# EAGLE design +YSOLAR PANEL (EAGLE 8.7.0)
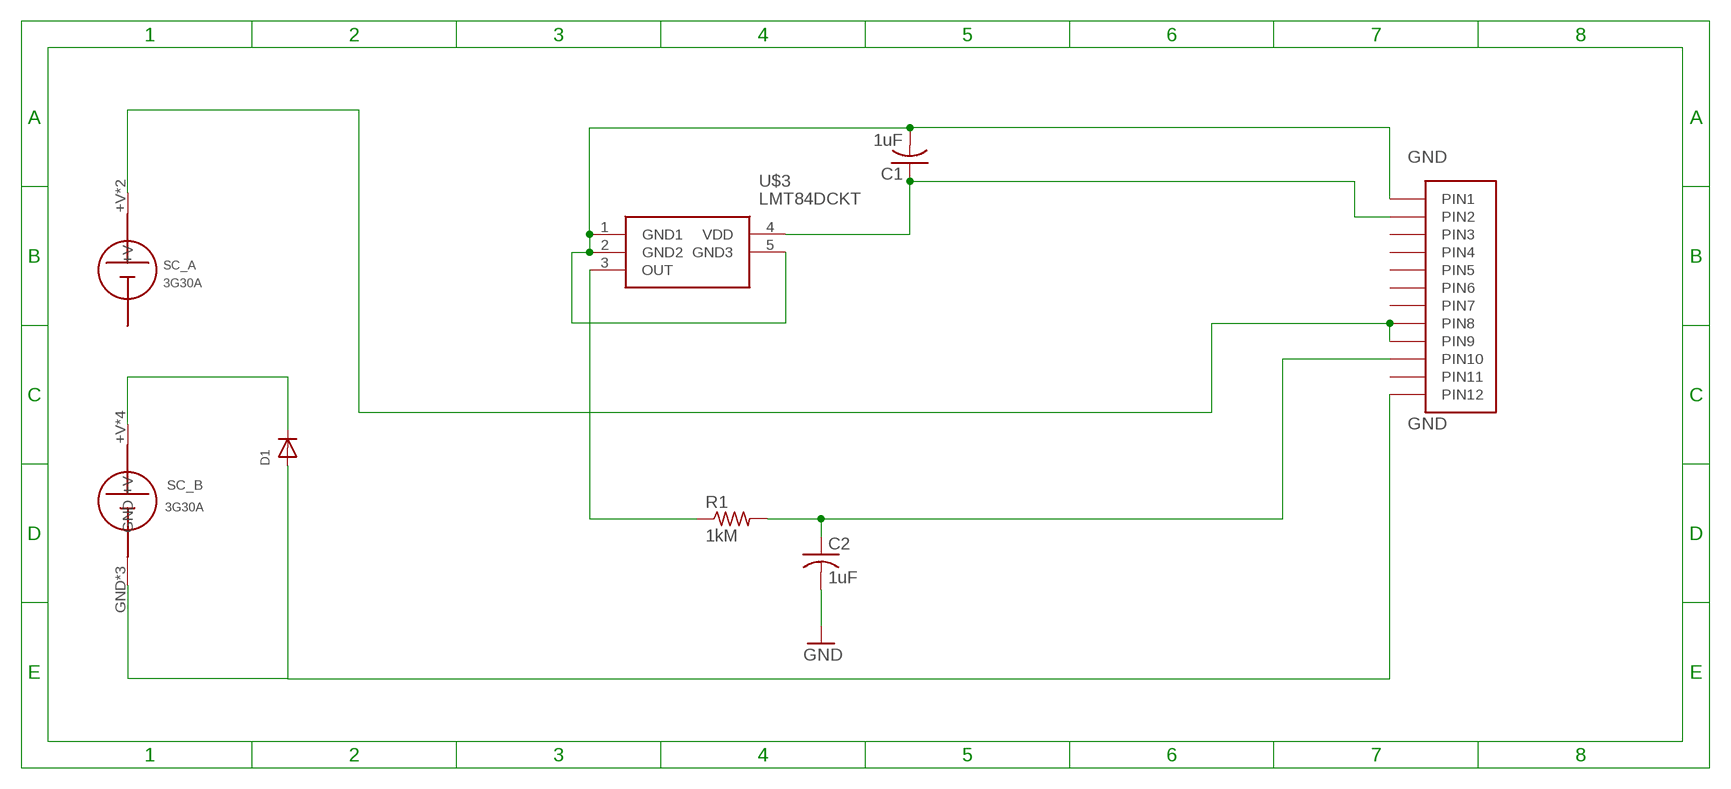
[diagram p0: schematic, sheet 1]

## Parts
C1  1uF  C-USC0805  [C0805]
C2  1uF  C-USC0805  [C0805]
D1  DIODE_SOD-123FL  [SOD-123FL]
R1  1kM  R-US_R0402  [R0402]
SOLARCELL_A  SC_A  [SC_A]
SOLARCELL_B  SC_B  [SC_B]
U$1  HEADER12PIN  [HEADER12PIN]
U$3  LMT84DCKT  [SOT65P210X110-5N]

## Nets
+V: SOLARCELL_A.+V SOLARCELL_A.+V1(+V) U$1.P8(PIN8) U$1.P9(PIN9)
+VB: D1.C SOLARCELL_B.+V SOLARCELL_B.+V2(+V) SOLARCELL_B.+V3(+V) SOLARCELL_B.+V4(+V)
GND: C1.2 C2.2 D1.A SOLARCELL_B.GND SOLARCELL_B.GND1(GND) SOLARCELL_B.GND2(GND) U$1.P1(PIN1) U$1.P12(PIN12) U$3.1(GND1) U$3.2(GND2) U$3.5(GND3)
N$11: C1.1 U$1.P2(PIN2) U$3.4(VDD)
N$16: R1.1 U$3.3(OUT)
N$19: C2.1 R1.2 U$1.P10(PIN10)
Unconnected: U$1.P3(PIN3) U$1.P4(PIN4) U$1.P5(PIN5) U$1.P6(PIN6) U$1.P7(PIN7) U$1.P11(PIN11)

## Library data of the parts
C1 C2 = adafruit:C-US: CAPACITOR, American symbol
D1 = adafruit:DIODE: Diode SMADIODE - SMA Surface Mount Package 20V 1A Schottky Diode Digikey: 641-1014-6-ND DO-1N4148 - Through Hole Small Current Diode SOD-123 20V 1 A (.5mV Vf) Schottky Diode - Digikey: MBRX120TPMSCT-ND SOD-323 10V 570mA (.38mV Vf, 3ns) Schottky Diode - Digikey: ZLLS410CT-ND SOD-523 30V 30mA Schottky Diode (RB751S-40TE61) - Digikey: RB751S-40TE61CT-ND SOT23-R/W - SOT23 Package (R = Solder Paste/Reflow Ovens, W = Hand-Soldering) BAT54Film 40V 300mA - Digikey: 497-7162-1-ND
R1 = adafruit:R-US_: RESISTOR, American symbol
SOLARCELL_A = SC_A:SC_A
SOLARCELL_B = SC_B-2:SC_B
U$1 = BIRDS:HEADER12PIN
U$3 = LMT84DCKT:LMT84DCKT: 1.5V-Capable, 10 uA Analog Output Temperature Sensor in SC70 and TO-92 Source: Datasheet <http://uk.rs-online.com/web/p/products/8115860>; DESCRIPTION: 1.5V-Capable, 10 uA Analog Output Temperature Sensor in SC70 and TO-92; HEIGHT: 1.1mm; MANUFACTURER_NAME: Texas Instruments; MANUFACTURER_PART_NUMBER: LMT84DCKT; RS_PART_NUMBER: 8115860

## Board
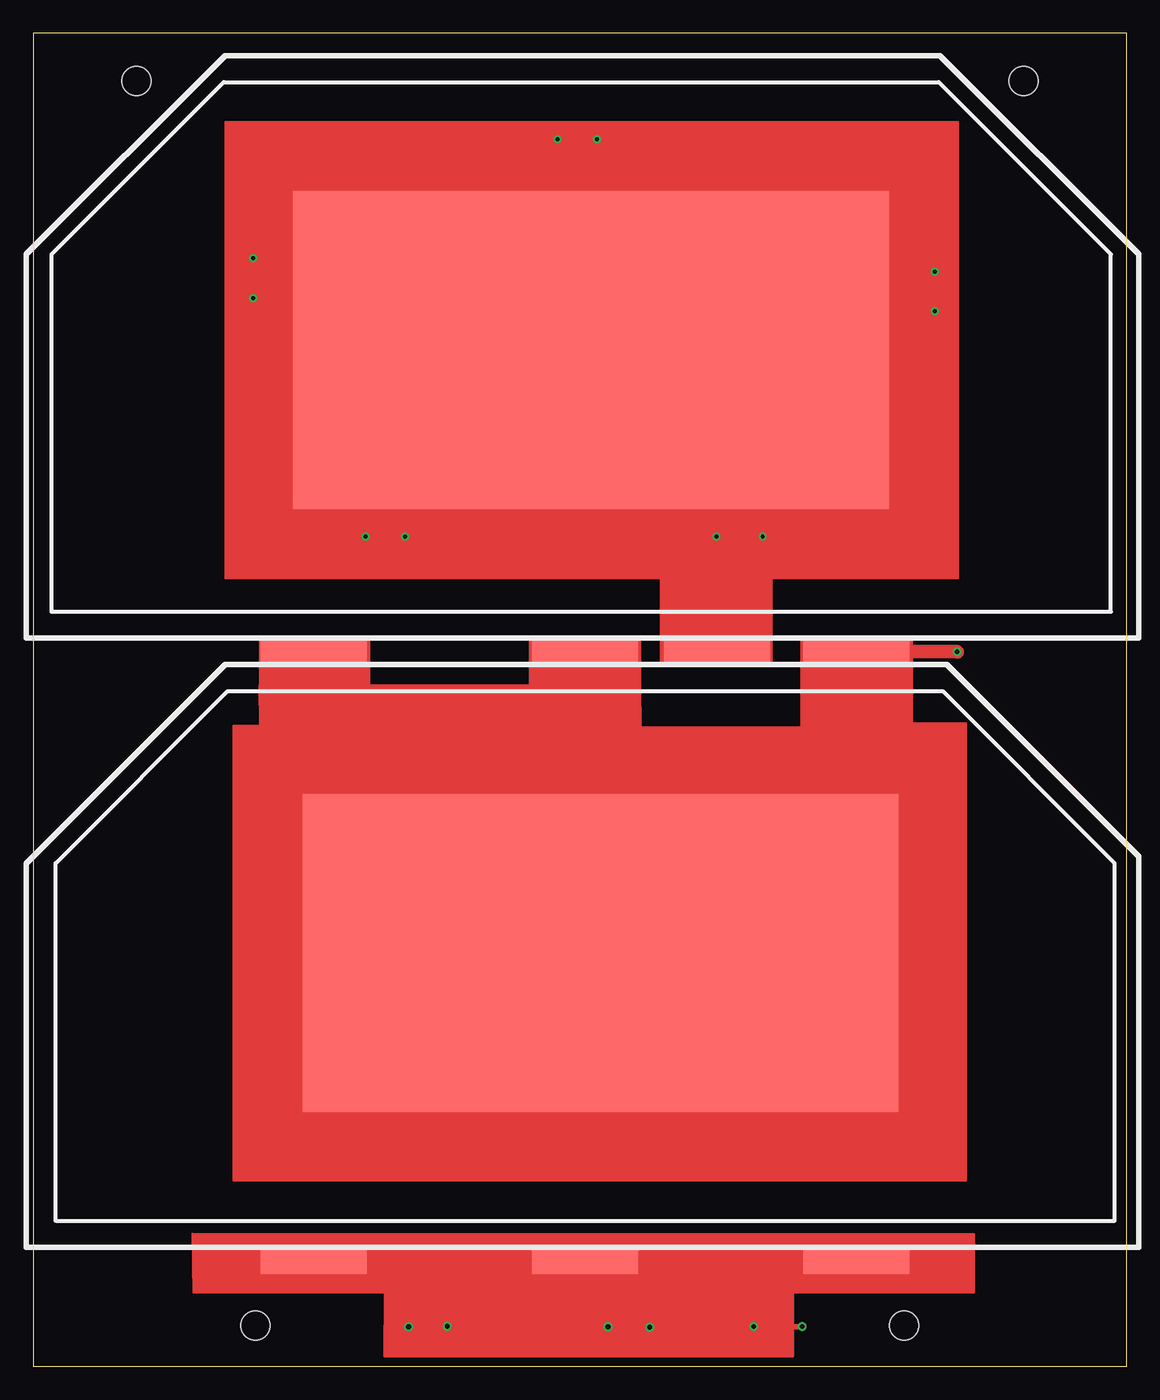
[diagram p1: board, top side]
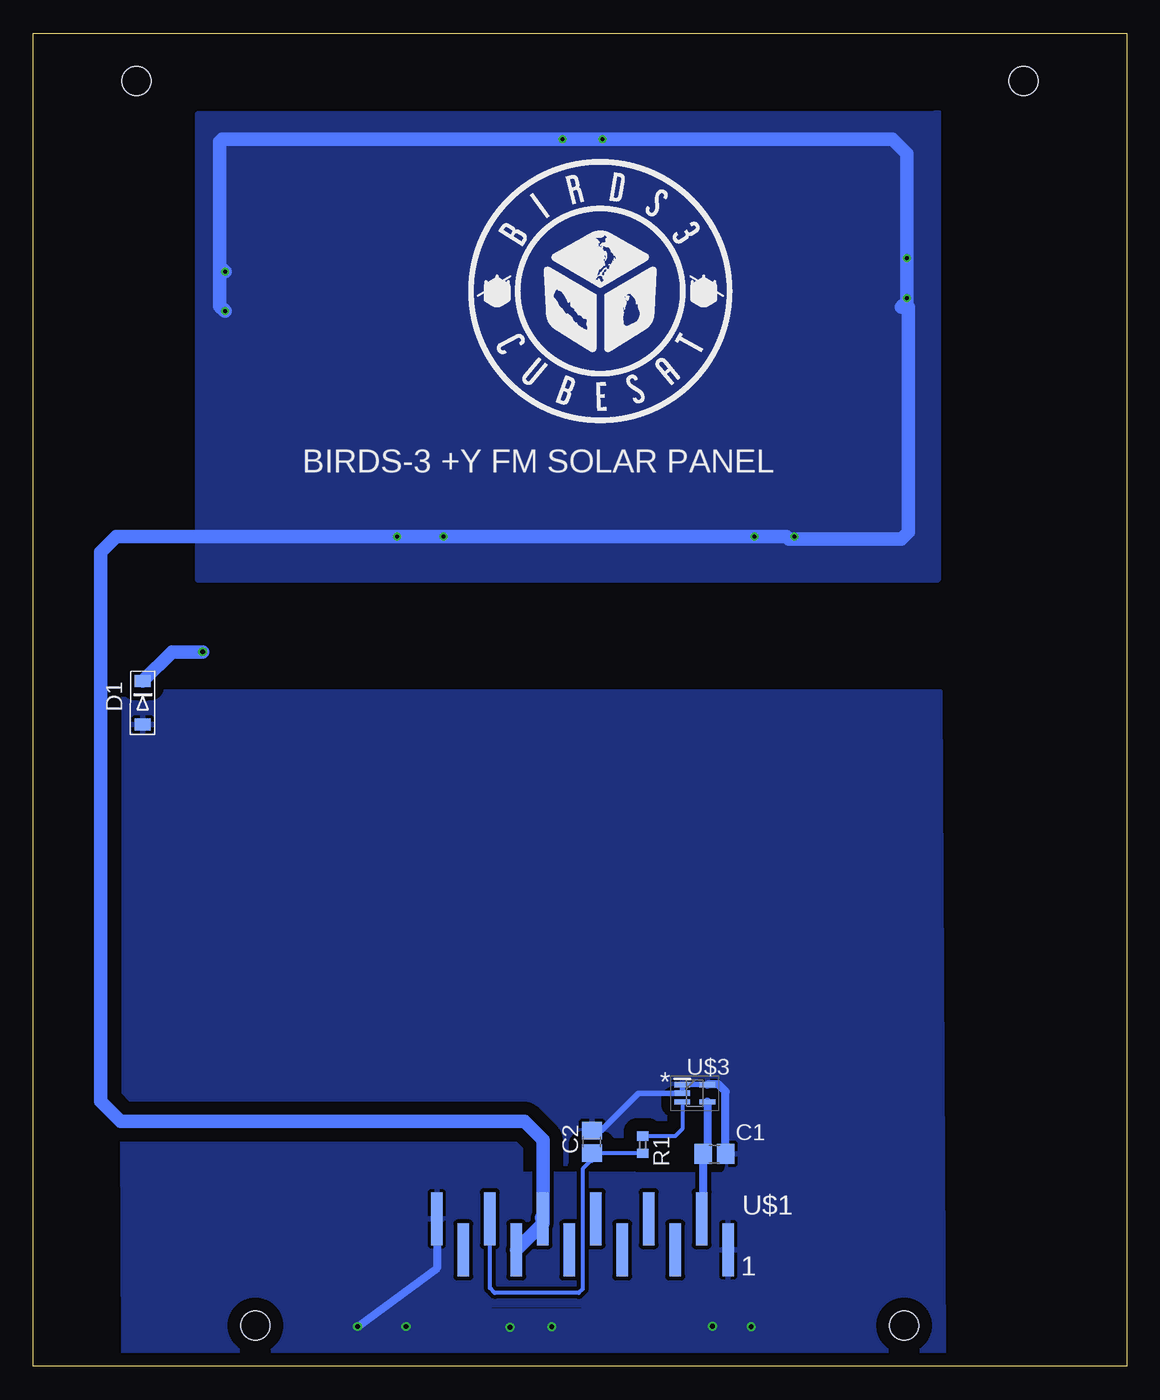
[diagram p2: board, bottom side, seen from below]

Size 82.6 x 100.7 mm. Coordinates in mm from the lower left corner, seen from the top.
Outline: 0,0 82.6,0 82.6,100.7 0,100.7 0,0
Copper layers (1*16): Top 0.035mm / dielectric 1.53mm / Bottom 0.035mm
Design rules "pban_5mil-l2": minimum track width 5mil, minimum drill 0.3mm, track to track 5mil, track to pad 0.229mm, pad to pad 5mil, via to via 5mil, smd to smd 5mil, copper to edge 0.5mm, drill to drill 0.5mm, minimum pad ring 0.15mm, minimum via ring 0.15mm, stop-mask expansion 4mil, vias tented up to drill 0.35mm, thermal gap 10mil
Holes 2.2 mm at 16.8,3.1 65.8,3.1 7.8,97.1 74.8,97.1

### Footprints (pad centres in the part's own frame; a part is rotated, then mirrored left to right if it is on the bottom)
C0805 = smd 1.3 x 1.5: 1 -0.85,0; 2 0.85,0
SOD-123FL = smd 0.91 x 1.22 bottom: A 1.637,0; C -1.637,0
R0402 = smd 0.7 x 0.9: 1 -0.65,0; 2 0.65,0
SC_A = smd 45 x 24: +V 40.75,19.75 | smd 8 x 2: +V1 50.25,-3
SC_B = smd 45 x 24: +V 41.14,20.22 | smd 8 x 2: +V2 19.5,43; +V3 40,43; +V4 60.5,43; GND 60.5,-3; GND1 19.5,-3; GND2 40,-3
HEADER12PIN = smd 4 x 0.89: P1 0,0; P2 2.35,2; P3 0,4; P4 2.35,6; P5 0,8; P6 2.35,10; P7 0,12; P8 2.35,14; P9 0,16; P10 2.35,18; P11 0,20; P12 2.35,22
SOT65P210X110-5N = smd 1.2 x 0.4: 1 -0.95,0.65; 2 -0.95,0; 3 -0.95,-0.65; 4 0.95,-0.65; 5 0.95,0.65

### Placement (x,y rotation side)
C1  31.14,16.05 0 bottom
C2  40.39,16.95 90 bottom
D1  74.32,50.12 270 top
R1  36.56,16.74 270 bottom
SOLARCELL_A  1.4,57 0 top
SOLARCELL_B  1.7,11 0 top
U$1  30.1,8.8 90 bottom
U$3  32.62,20.63 0 bottom

### Tracks (layer width: path | path; a pad name or v marks a point on that pad's centre or on a via)
+V  (via drill 0.3)
  Top 1.016: v51.61,62.69 51.61,54.04 SOLARCELL_A.+V1 | v42.61,92.69 42.61,77.21 SOLARCELL_A.+V
  Bottom 1.016: 44.18,11.23 U$1.P8 | U$1.P8 44.1,10.8 U$1.P9 | v42.61,92.69 42,92.69 | v42.61,92.69 68.31,92.69 68.5,92.5 68.5,83.08 | 68.5,83.08 v68.11,82.69 | 68.5,83.08 68.5,80.08 v68.11,79.69 | U$1.P8 44.1,17.1 45.5,18.5 76,18.5 77.5,20 77.5,61.5 76.31,62.69 v55.11,62.69 v51.61,62.69 v28.11,62.69 25.69,62.69 25.5,62.5 17,62.5 16.5,63 16.5,80 17,80 16.61,80.39 v16.61,83.69 16.61,91.61 17.69,92.69 v39.61,92.69 v42.61,92.69
  other vias: 25.11,62.69 16.61,80.69
  pour Bottom (isolate 0.305): 14.4,94.5 70.1,94.5 70.1,59.5 14.3,59.5 14.3,94.7
+VB  (via drill 0.35)
  Top 0.406: SOLARCELL_B.+V2 21.2,44.4 21.93,43.67 31.37,43.67 SOLARCELL_B.+V3 41.76,53.94 44.53,53.94 44.53,44.05 44.68,43.9 | 44.68,43.9 59.72,43.9 61.89,46.07 61.89,53.69 SOLARCELL_B.+V4 | 44.68,43.9 44.68,33.06 SOLARCELL_B.+V
  Top 1.016: SOLARCELL_B.+V4 69.77,54 v69.79,53.97
  Bottom 1.016: v69.79,53.97 72.11,53.97 D1.C
GND  (via drill 0.35)
  Top 0.406: v31.29,3.03 26.32,8 SOLARCELL_B.GND1 | v46.58,2.96 40.08,6.38 SOLARCELL_B.GND2 | SOLARCELL_B.GND 55.65,8 50.65,3 v58.09,3
  Bottom 0.406: U$3.5 U$3.1 U$3.2 36.87,20.63 39.7,17.8 C2.2
  Bottom 0.61: U$1.P12 52.1,7.42 v58.09,3 | C1.2 30.29,20.76 30.82,21.28 U$3.5
  other vias: 28.36,3 43.42,3 54.43,3.02
  pour Bottom (isolate 1): 14.1,50.92 76,50.92 75.76,1.12 13.86,1.12
  pour Bottom (isolate 0.305): 28.21,14.5 54.82,14.62 54.82,13.71 55.06,4.53 48.01,4.62 32.72,4.62 28.35,6.61
N$11
  Bottom 0.61: U$3.4 31.67,16.37 C1.1 31.99,11.26 U$1.P2
N$16
  Bottom 0.305: U$3.3 33.57,17.93 34.11,17.39 R1.1
N$19
  Bottom 0.305: C2.1 40.39,15.52 | U$1.P10 48.1,5.92 47.73,5.55 41.39,5.55 41.1,5.84 41.1,14.9 40.39,15.62 C2.1 | R1.2 40.37,16.09 C2.1

### Text on the board
bPlace: BIRDS-3 +Y FM SOLAR PANEL | * | U$1 | 1